# EAGLE design Dashboard Logic (EAGLE 5.11)
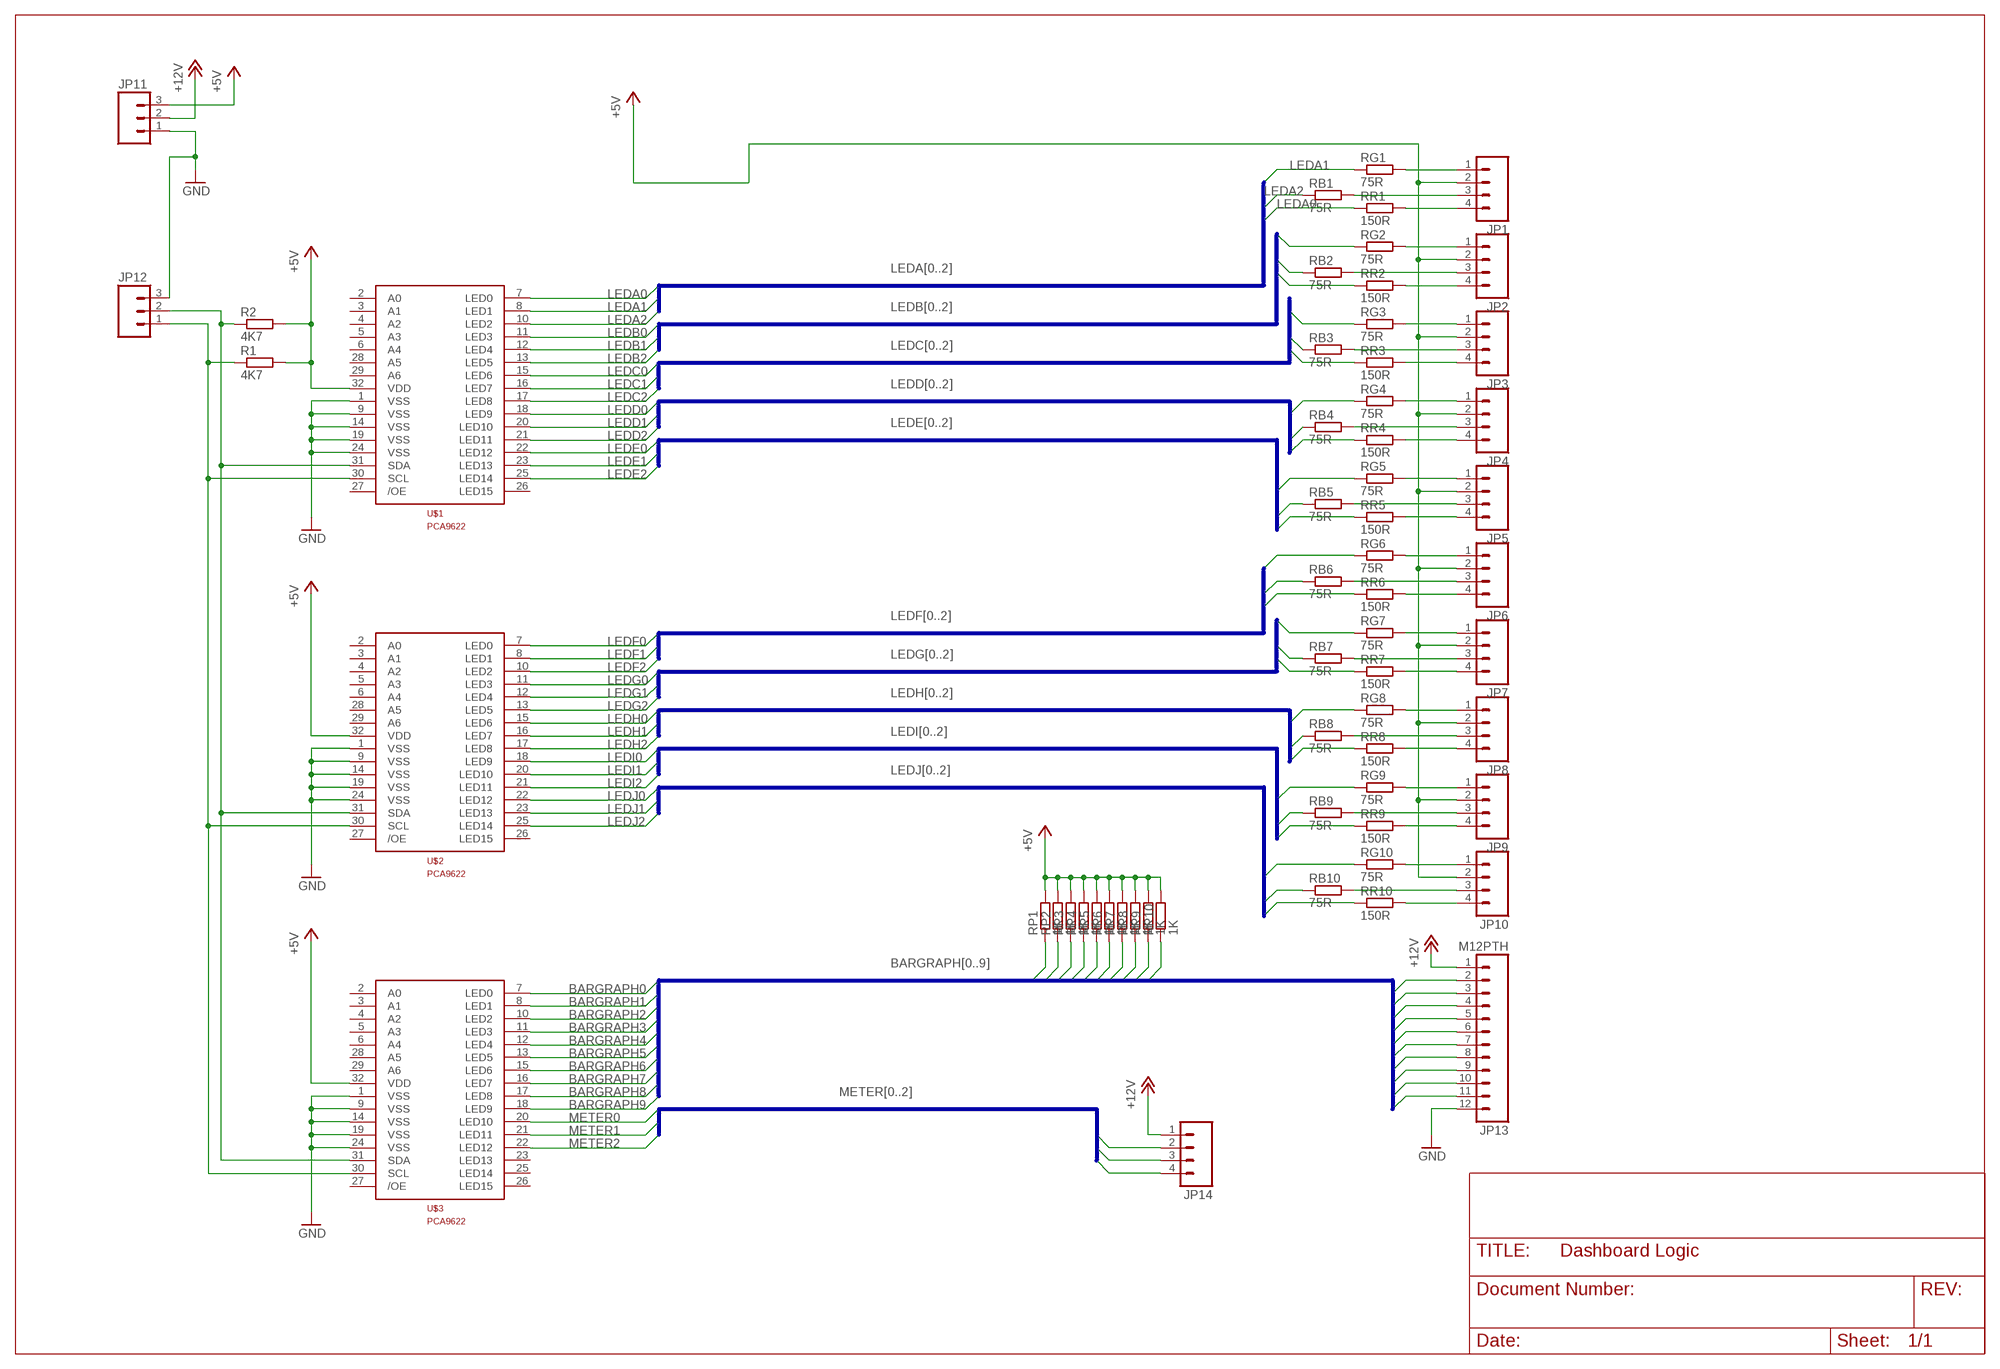
[diagram p0: schematic, sheet 1]

## Parts
JP1  M04PTH  [1X04]
JP2  M04PTH  [1X04]
JP3  M04PTH  [1X04]
JP4  M04PTH  [1X04]
JP5  M04PTH  [1X04]
JP6  M04PTH  [1X04]
JP7  M04PTH  [1X04]
JP8  M04PTH  [1X04]
JP9  M04PTH  [1X04]
JP10  M04PTH  [1X04]
JP11  M03PTH  [1X03]
JP12  M03PTH  [1X03]
JP13  M12PTH  [1X12]
JP14  M04PTH  [1X04]
R1  4K7  R-EU_R0805  [R0805]
R2  4K7  R-EU_R0805  [R0805]
RB1  75R  R-EU_R0805  [R0805]
RB2  75R  R-EU_R0805  [R0805]
RB3  75R  R-EU_R0805  [R0805]
RB4  75R  R-EU_R0805  [R0805]
RB5  75R  R-EU_R0805  [R0805]
RB6  75R  R-EU_R0805  [R0805]
RB7  75R  R-EU_R0805  [R0805]
RB8  75R  R-EU_R0805  [R0805]
RB9  75R  R-EU_R0805  [R0805]
RB10  75R  R-EU_R0805  [R0805]
RG1  75R  R-EU_R0805  [R0805]
RG2  75R  R-EU_R0805  [R0805]
RG3  75R  R-EU_R0805  [R0805]
RG4  75R  R-EU_R0805  [R0805]
RG5  75R  R-EU_R0805  [R0805]
RG6  75R  R-EU_R0805  [R0805]
RG7  75R  R-EU_R0805  [R0805]
RG8  75R  R-EU_R0805  [R0805]
RG9  75R  R-EU_R0805  [R0805]
RG10  75R  R-EU_R0805  [R0805]
RP1  1K  R-EU_R0805  [R0805]
RP2  1K  R-EU_R0805  [R0805]
RP3  1K  R-EU_R0805  [R0805]
RP4  1K  R-EU_R0805  [R0805]
RP5  1K  R-EU_R0805  [R0805]
RP6  1K  R-EU_R0805  [R0805]
RP7  1K  R-EU_R0805  [R0805]
RP8  1K  R-EU_R0805  [R0805]
RP9  1K  R-EU_R0805  [R0805]
RP10  1K  R-EU_R0805  [R0805]
RR1  150R  R-EU_R0805  [R0805]
RR2  150R  R-EU_R0805  [R0805]
RR3  150R  R-EU_R0805  [R0805]
RR4  150R  R-EU_R0805  [R0805]
RR5  150R  R-EU_R0805  [R0805]
RR6  150R  R-EU_R0805  [R0805]
RR7  150R  R-EU_R0805  [R0805]
RR8  150R  R-EU_R0805  [R0805]
RR9  150R  R-EU_R0805  [R0805]
RR10  150R  R-EU_R0805  [R0805]
U$1  PCA9622  [HTSSOP32DAP]
U$2  PCA9622  [HTSSOP32DAP]
U$3  PCA9622  [HTSSOP32DAP]

## Nets
+5V: JP1.2 JP2.2 JP3.2 JP4.2 JP5.2 JP6.2 JP7.2 JP8.2 JP9.2 JP10.2 JP11.3 R1.2 R2.2 RP1.2 RP2.2 RP3.2 RP4.2 RP5.2 RP6.2 RP7.2 RP8.2 RP9.2 RP10.2 U$1.32(VDD) U$2.32(VDD) U$3.32(VDD)
+12V: JP11.2 JP13.1 JP14.1
BARGRAPH0: JP13.2 RP1.1 U$3.7(LED0)
BARGRAPH1: JP13.3 RP2.1 U$3.8(LED1)
BARGRAPH2: JP13.4 RP3.1 U$3.10(LED2)
BARGRAPH3: JP13.5 RP4.1 U$3.11(LED3)
BARGRAPH4: JP13.6 RP5.1 U$3.12(LED4)
BARGRAPH5: JP13.7 RP6.1 U$3.13(LED5)
BARGRAPH6: JP13.8 RP7.1 U$3.15(LED6)
BARGRAPH7: JP13.9 RP8.1 U$3.16(LED7)
BARGRAPH8: JP13.10 RP9.1 U$3.17(LED8)
BARGRAPH9: JP13.11 RP10.1 U$3.18(LED9)
GND: JP11.1 JP12.3 JP13.12 U$1.1(VSS) U$1.9(VSS) U$1.14(VSS) U$1.19(VSS) U$1.24(VSS) U$2.1(VSS) U$2.9(VSS) U$2.14(VSS) U$2.19(VSS) U$2.24(VSS) U$3.1(VSS) U$3.9(VSS) U$3.14(VSS) U$3.19(VSS) U$3.24(VSS)
LEDA0: RR1.1 U$1.7(LED0)
LEDA1: RG1.1 U$1.8(LED1)
LEDA2: RB1.1 U$1.10(LED2)
LEDB0: RR2.1 U$1.11(LED3)
LEDB1: RG2.1 U$1.12(LED4)
LEDB2: RB2.1 U$1.13(LED5)
LEDC0: RR3.1 U$1.15(LED6)
LEDC1: RG3.1 U$1.16(LED7)
LEDC2: RB3.1 U$1.17(LED8)
LEDD0: RR4.1 U$1.18(LED9)
LEDD1: RG4.1 U$1.20(LED10)
LEDD2: RB4.1 U$1.21(LED11)
LEDE0: RR5.1 U$1.22(LED12)
LEDE1: RG5.1 U$1.23(LED13)
LEDE2: RB5.1 U$1.25(LED14)
LEDF0: RR6.1 U$2.7(LED0)
LEDF1: RG6.1 U$2.8(LED1)
LEDF2: RB6.1 U$2.10(LED2)
LEDG0: RR7.1 U$2.11(LED3)
LEDG1: RG7.1 U$2.12(LED4)
LEDG2: RB7.1 U$2.13(LED5)
LEDH0: RR8.1 U$2.15(LED6)
LEDH1: RG8.1 U$2.16(LED7)
LEDH2: RB8.1 U$2.17(LED8)
LEDI0: RR9.1 U$2.18(LED9)
LEDI1: RG9.1 U$2.20(LED10)
LEDI2: RB9.1 U$2.21(LED11)
LEDJ0: RR10.1 U$2.22(LED12)
LEDJ1: RG10.1 U$2.23(LED13)
LEDJ2: RB10.1 U$2.25(LED14)
METER0: JP14.2 U$3.20(LED10)
METER1: JP14.3 U$3.21(LED11)
METER2: JP14.4 U$3.22(LED12)
N$1: JP12.2 R2.1 U$1.31(SDA) U$2.31(SDA) U$3.31(SDA)
N$2: JP1.1 RG1.2
N$3: JP1.3 RB1.2
N$4: JP1.4 RR1.2
N$5: JP10.4 RR10.2
N$6: JP12.1 R1.1 U$1.30(SCL) U$2.30(SCL) U$3.30(SCL)
N$7: JP10.3 RB10.2
N$8: JP10.1 RG10.2
N$9: JP9.4 RR9.2
N$10: JP9.3 RB9.2
N$11: JP9.1 RG9.2
N$12: JP8.4 RR8.2
N$13: JP8.3 RB8.2
N$14: JP8.1 RG8.2
N$15: JP7.4 RR7.2
N$16: JP7.3 RB7.2
N$17: JP7.1 RG7.2
N$18: JP6.4 RR6.2
N$19: JP6.3 RB6.2
N$20: JP6.1 RG6.2
N$21: JP5.4 RR5.2
N$22: JP5.3 RB5.2
N$23: JP5.1 RG5.2
N$24: JP4.4 RR4.2
N$25: JP4.3 RB4.2
N$26: JP4.1 RG4.2
N$27: JP3.4 RR3.2
N$28: JP3.3 RB3.2
N$29: JP3.1 RG3.2
N$30: JP2.4 RR2.2
N$31: JP2.3 RB2.2
N$32: JP2.1 RG2.2
Unconnected: U$1.2(A0) U$1.3(A1) U$1.4(A2) U$1.5(A3) U$1.6(A4) U$1.26(LED15) U$1.27(/OE) U$1.28(A5) U$1.29(A6) U$2.2(A0) U$2.3(A1) U$2.4(A2) U$2.5(A3) U$2.6(A4) U$2.26(LED15) U$2.27(/OE) U$2.28(A5) U$2.29(A6) U$3.2(A0) U$3.3(A1) U$3.4(A2) U$3.5(A3) U$3.6(A4) U$3.23(LED13) U$3.25(LED14) U$3.26(LED15) U$3.27(/OE) U$3.28(A5) U$3.29(A6)

## Buses
LEDA[0..2]
LEDB[0..2]
LEDC[0..2]
LEDD[0..2]
LEDE[0..2]
LEDF[0..2]
LEDG[0..2]
LEDH[0..2]
LEDI[0..2]
LEDJ[0..2]
BARGRAPH[0..9]
METER[0..2]

## Library data of the parts
JP1-JP10 JP14 = SparkFun:M04: Header 4 Standard 4-pin 0.1" header. Use with straight break away headers (SKU : PRT-00116), right angle break away headers (PRT-00553), swiss pins (PRT-00743), machine pins (PRT-00117), and female headers (PRT-00115). Molex polarized connector foot print use with SKU : PRT-08231 with associated crimp pins and housings. 1MM SMD Version SKU: PRT-10208
JP11 JP12 = SparkFun:M03: Header 3 Standard 3-pin 0.1" header. Use with straight break away headers (SKU : PRT-00116), right angle break away headers (PRT-00553), swiss pins (PRT-00743), machine pins (PRT-00117), and female headers (PRT-00115). Molex polarized connector foot print use with SKU : PRT-08232 with associated crimp pins and housings.
JP13 = SparkFun:M12: Header 12 Standard 12-pin 0.1" header. Use with straight break away headers (SKU : PRT-00116), right angle break away headers (PRT-00553), swiss pins (PRT-00743), machine pins (PRT-00117), and female headers (PRT-00115).
R1 R2 RB1-RB10 RG1-RG10 RP1-RP10 RR1-RR10 = resistor:R-EU_: RESISTOR, European symbol
U$1-U$3 = DashboardParts:PCA9622

## Board
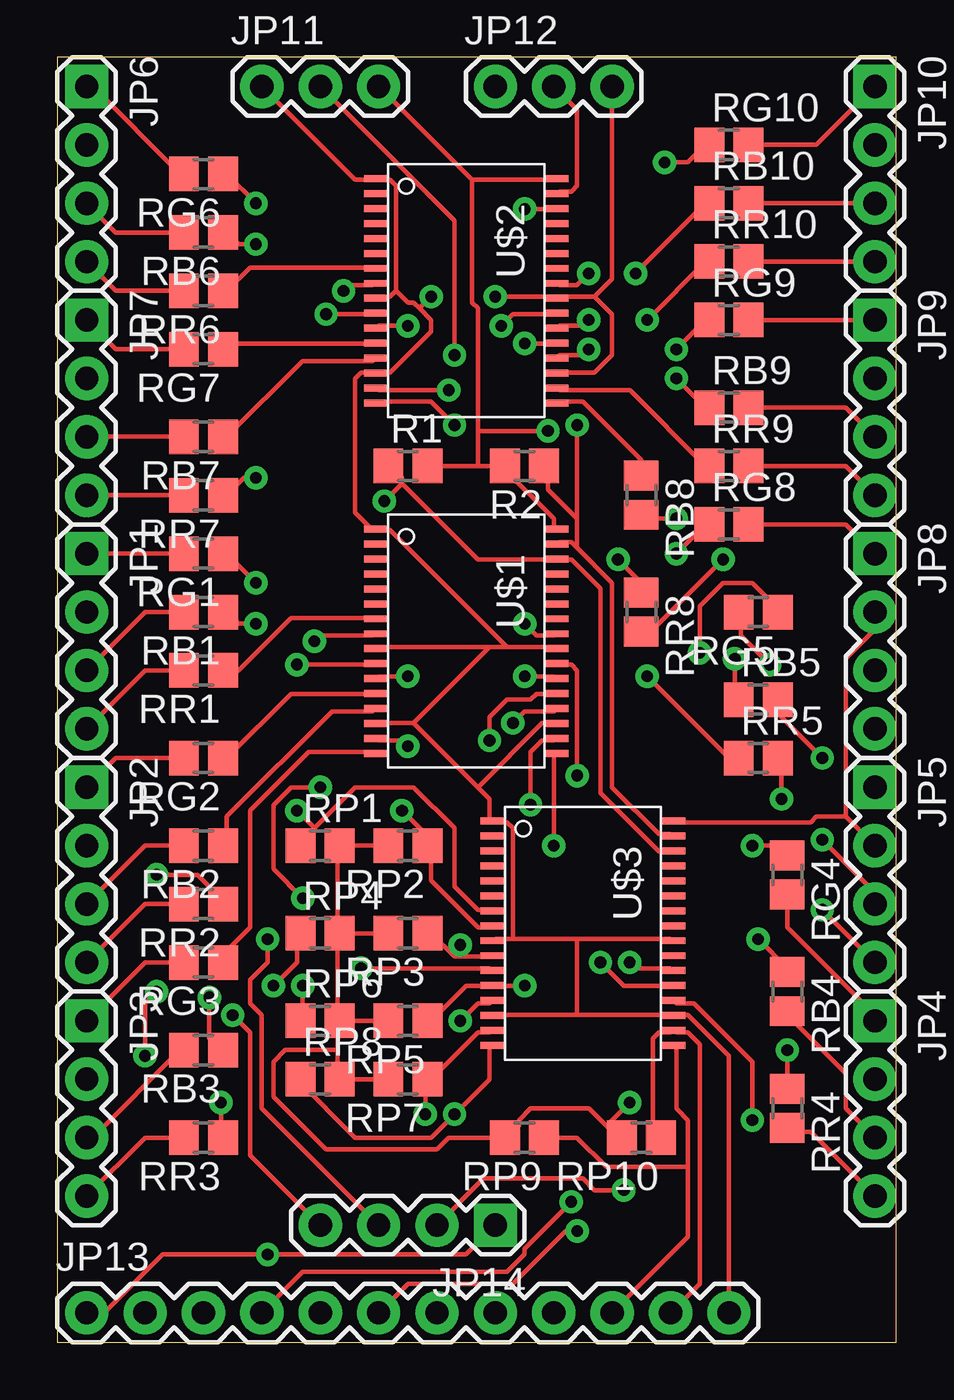
[diagram p1: board, top side]
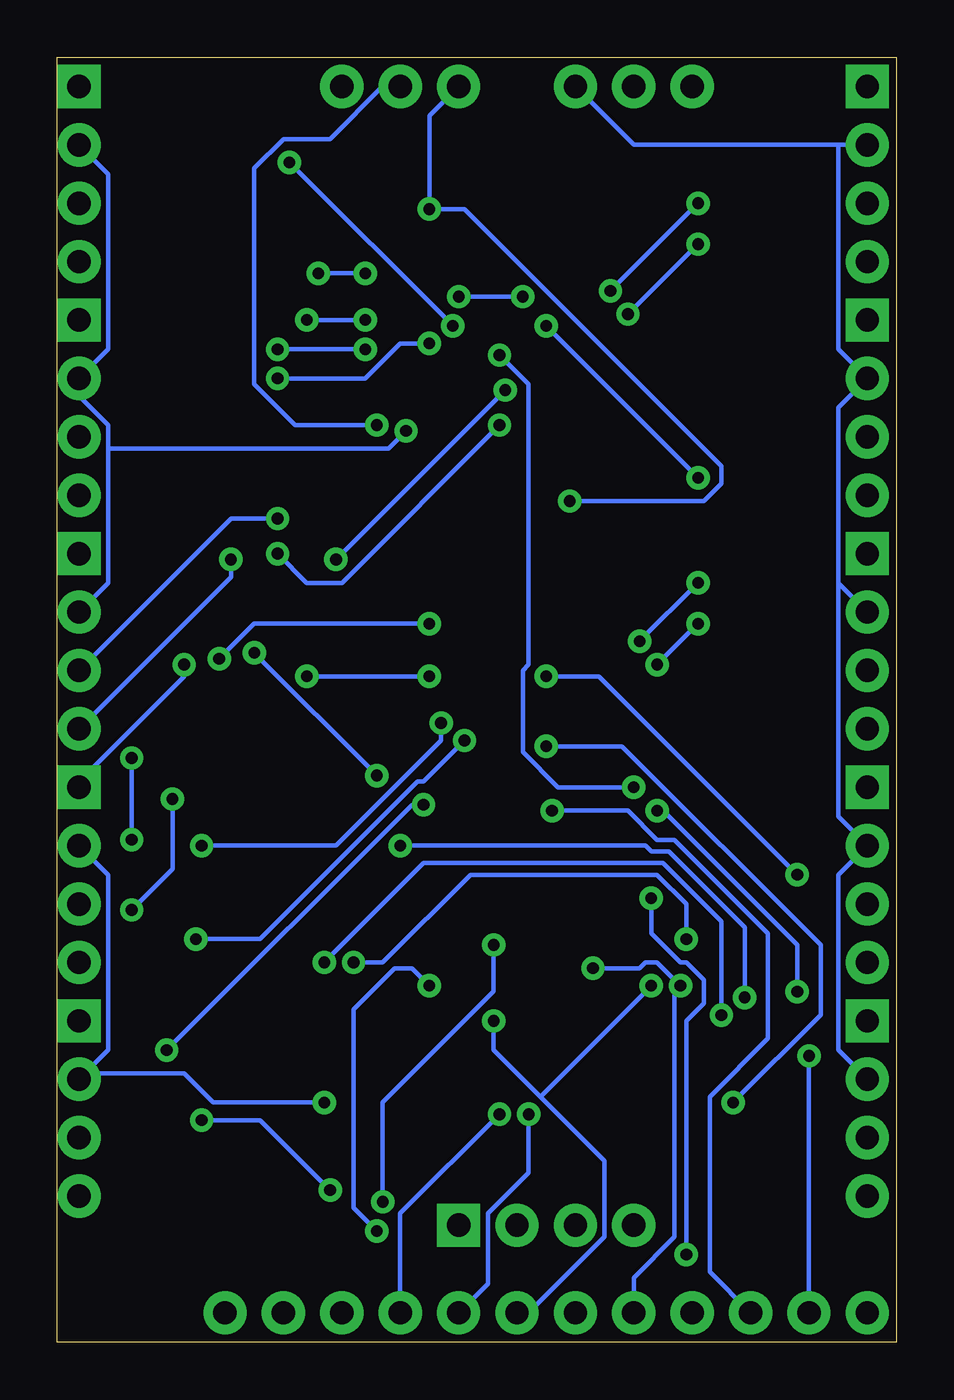
[diagram p2: board, bottom side, seen from below]

Size 36.5 x 55.87 mm. Coordinates in mm from the lower left corner, seen from the top.
Outline: 0,0 36.5,0 36.5,55.87 0,55.87 0,0
Copper layers (1*16): Top 0.035mm / dielectric 1.5mm / Bottom 0.035mm
Design rules "SparkFun *": minimum track width 8mil, minimum drill 20mil, track to track 8mil, track to pad 8mil, pad to pad 8mil, via to via 8mil, smd to smd 8mil, copper to edge 0mil, drill to drill 8mil, minimum pad ring 12mil, minimum via ring 10mil, stop-mask expansion 4mil, vias tented up to drill 25mil, thermal gap 10mil

### Footprints (pad centres in the part's own frame; a part is rotated, then mirrored left to right if it is on the bottom)
1X04 = drill 1.016 pad 1.88 square: 1 0,0 | drill 1.016 pad 1.88 round: 2 2.54,0; 3 5.08,0; 4 7.62,0
1X03 = drill 1.016 pad 1.88 round: 1 0,0; 2 2.54,0; 3 5.08,0
1X12 = drill 1.016 pad 1.88 round: 1 0,0; 2 2.54,0; 3 5.08,0; 4 7.62,0; 5 10.16,0; 6 12.7,0; 7 15.24,0; 8 17.78,0; 9 20.32,0; 10 22.86,0; 11 25.4,0; 12 27.94,0
R0805 = smd 1.3 x 1.5: 1 -0.85,0; 2 0.85,0
HTSSOP32DAP = smd 0.3 x 1: 1 -4.875,-3.95; 2 -4.225,-3.95; 3 -3.575,-3.95; 4 -2.925,-3.95; 5 -2.275,-3.95; 6 -1.625,-3.95; 7 -0.975,-3.95; 8 -0.325,-3.95; 9 0.325,-3.95; 10 0.975,-3.95; 11 1.625,-3.95; 12 2.275,-3.95; 13 2.925,-3.95; 14 3.575,-3.95; 15 4.225,-3.95; 16 4.875,-3.95; 17 4.875,3.95; 18 4.225,3.95; 19 3.575,3.95; 20 2.925,3.95; 21 2.275,3.95; 22 1.625,3.95; 23 0.975,3.95; 24 0.325,3.95; 25 -0.325,3.95; 26 -0.975,3.95; 27 -1.625,3.95; 28 -2.275,3.95; 29 -2.925,3.95; 30 -3.575,3.95; 31 -4.225,3.95; 32 -4.875,3.95

### Placement (x,y rotation side)
JP1  1.27,34.29 270 top
JP2  1.27,24.13 270 top
JP3  1.27,13.97 270 top
JP4  35.56,13.97 270 top
JP5  35.56,24.13 270 top
JP6  1.27,54.61 270 top
JP7  1.27,44.45 270 top
JP8  35.56,34.29 270 top
JP9  35.56,44.45 270 top
JP10  35.56,54.61 270 top
JP11  8.89,54.61 0 top
JP12  19.05,54.61 0 top
JP13  1.27,1.27 0 top
JP14  19.05,5.08 180 top
R1  15.24,38.1 0 top
R2  20.32,38.1 180 top
RB1  6.35,31.75 180 top
RB2  6.35,21.59 180 top
RB3  6.35,12.7 180 top
RB4  31.75,15.24 270 top
RB5  30.48,27.94 0 top
RB6  6.35,48.26 180 top
RB7  6.35,39.37 180 top
RB8  25.4,36.83 270 top
RB9  29.21,40.64 0 top
RB10  29.21,49.53 0 top
RG1  6.35,34.29 180 top
RG2  6.35,25.4 180 top
RG3  6.35,16.51 180 top
RG4  31.75,20.32 270 top
RG5  30.48,31.75 180 top
RG6  6.35,50.8 180 top
RG7  6.35,43.18 180 top
RG8  29.21,35.56 0 top
RG9  29.21,44.45 0 top
RG10  29.21,52.07 0 top
RP1  11.43,21.59 0 top
RP2  15.24,21.59 180 top
RP3  15.24,17.78 180 top
RP4  11.43,17.78 0 top
RP5  15.24,13.97 180 top
RP6  11.43,13.97 0 top
RP7  15.24,11.43 180 top
RP8  11.43,11.43 0 top
RP9  20.32,8.89 180 top
RP10  25.4,8.89 180 top
RR1  6.35,29.21 180 top
RR2  6.35,19.05 180 top
RR3  6.35,8.89 180 top
RR4  31.75,10.16 270 top
RR5  30.48,25.4 0 top
RR6  6.35,45.72 180 top
RR7  6.35,36.83 180 top
RR8  25.4,31.75 270 top
RR9  29.21,38.1 0 top
RR10  29.21,46.99 0 top
U$1  17.78,30.48 270 top
U$2  17.78,45.72 270 top
U$3  22.86,17.78 270 top

### Tracks (layer width: path | path; a pad name or v marks a point on that pad's centre or on a via)
+5V  (via drill 0.51)
  Top 0.203: 19.3,38.1 21.59,35.81 21.59,35.31 U$1.32 | 18.29,38.1 19.3,38.1 | 18.29,38.1 R1.2 | 19.3,38.1 R2.2 | 18.03,50.55 21.59,50.55 U$2.32 | JP11.3 18.03,50.55 | 18.29,39.62 18.29,44.96 18.03,45.21 18.03,50.55 | 18.29,39.62 18.29,38.1 | 23.88,9.4 24.38,8.89 RP10.2 | 23.88,9.4 23.11,10.16 20.57,10.16 20.07,9.65 20.07,9.4 19.56,8.89 RP9.2 17.02,8.89 16.51,8.38 11.68,8.38 9.4,10.67 9.4,12.19 9.91,12.7 12.19,12.7 | RP7.2 RP8.2 12.19,11.43 12.19,12.7 | RP5.2 RP6.2 12.19,13.97 | 12.19,12.7 12.19,13.97 | RP3.2 RP4.2 12.19,17.78 | RP2.2 RP1.2 12.19,21.59 12.19,17.78 | 12.19,13.97 12.19,17.78 | 34.29,22.86 33.02,22.86 32.77,22.61 26.92,22.61 U$3.32 | 34.29,22.86 JP5.2 | JP8.2 35.56,30.99 34.29,29.72 34.29,22.86 | v24.89,10.41 23.88,9.4 | 18.29,39.62 v21.34,39.62
  Bottom 0.203: JP3.2 2.54,12.7 2.54,20.32 JP2.2 2.54,22.86 2.54,33.02 | 2.54,33.02 JP1.2 | 2.54,33.02 2.54,40.64 JP7.2 2.54,43.18 2.54,52.07 | 2.54,52.07 11.43,52.07 JP11.3 | 2.54,52.07 JP6.2 | JP10.2 34.29,50.8 34.29,43.18 JP9.2 35.56,41.15 34.29,39.88 34.29,38.86 | 35.31,11.68 34.29,12.7 34.29,20.32 JP5.2 | 34.29,38.86 34.29,33.02 JP8.2 | v24.89,10.41 29.72,10.41 30.99,11.68 35.31,11.68 | 35.31,11.68 JP4.2 | v21.34,39.62 22.1,38.86 34.29,38.86
+12V  (via drill 0.51)
  Top 0.203: JP13.1 2.03,1.27 4.57,3.81 v9.14,3.81 17.78,3.81 JP14.1 | JP11.2 17.27,48.77 v17.27,42.93 | v11.43,24.13 10.16,24.13 9.4,23.37 9.4,20.57 v10.67,19.3
  Bottom 0.203: v17.27,42.93 16,41.66 16,29.46 16.26,29.21 16.26,25.65 14.73,24.13 v11.43,24.13 | v10.67,19.3 10.67,17.78 9.4,16.51 9.14,16.51 8.38,15.75 8.38,14.73 9.14,13.97 v9.14,3.81
BARGRAPH0  (via drill 0.51)
  Top 0.203: 11.18,22.35 10.41,21.59 RP1.1 | 11.18,22.35 12.95,24.13 15.49,24.13 17.27,22.35 17.27,19.81 18.29,18.8 18.8,18.8 U$3.7 | v3.81,12.45 3.81,14.73 v4.32,15.24 | v10.41,23.11 11.18,22.35
  Bottom 0.203: JP13.2 v3.81,12.45 | v4.32,15.24 4.32,17.27 10.16,23.11 v10.41,23.11
BARGRAPH1  (via drill 0.51)
  Top 0.203: U$3.8 18.8,18.03 18.29,18.03 16.26,20.07 16.26,21.59 RP2.1 16,21.59 16,22.1 v14.99,23.11
  Bottom 0.203: v14.99,23.11 11.68,23.11 10.41,21.84 9.65,21.84 5.59,17.78 5.59,13.21 8.13,10.67 8.13,3.05 JP13.3
BARGRAPH2  (via drill 0.51)
  Top 0.203: 17.53,16.76 17.27,16.76 16.26,17.78 RP3.1 | 17.53,16.76 18.8,16.76 U$3.10 | v17.53,17.27 17.53,16.76 | v22.35,6.1 20.32,4.06 20.32,3.81 19.56,3.05 10.67,3.05 JP13.4
  Bottom 0.203: v17.53,17.27 17.53,15.24 22.35,10.41 v22.35,6.1
BARGRAPH3  (via drill 0.51)
  Top 0.203: v13.21,16.26 18.8,16.26 U$3.11 | v9.4,15.49 10.41,16.51 10.41,17.78 RP4.1
  Bottom 0.203: v13.21,16.26 11.18,16.26 10.92,16.51 10.41,16.51 9.65,15.75 9.65,15.49 | 9.65,15.49 9.65,4.57 11.43,2.79 JP13.5 | 9.65,15.49 v9.4,15.49
BARGRAPH4  (via drill 0.51)
  Top 0.203: RP5.1 16.26,13.97 17.78,15.49 18.8,15.49 U$3.12 19.05,15.49 v20.32,15.49 | v22.61,4.83 22.1,4.83 19.81,2.54 15.24,2.54 JP13.6
  Bottom 0.203: v20.32,15.49 21.08,16.26 21.84,16.26 23.62,14.48 23.62,5.84 v22.61,4.83
BARGRAPH5  (via drill 0.51)
  Top 0.203: v17.53,13.97 18.29,14.73 18.8,14.73 U$3.13 | v10.67,15.49 10.67,13.97 RP6.1
  Bottom 0.203: v17.53,13.97 17.53,12.7 15.49,10.67 | 15.49,10.67 12.7,7.87 12.7,4.57 16,1.27 JP13.7 | 15.49,10.67 v10.67,15.49
BARGRAPH6  (via drill 0.51)
  Top 0.203: U$3.15 18.8,13.46 18.29,13.46 16.26,11.43 RP7.1 16,11.43 v16,9.91
  Bottom 0.203: v16,9.91 16,7.37 17.78,5.59 17.78,2.54 JP13.8
BARGRAPH7  (via drill 0.51)
  Top 0.203: U$3.16 18.8,12.95 18.8,11.43 v17.27,9.91 16.26,8.89 12.95,8.89 10.41,11.43 RP8.1
  Bottom 0.203: JP13.9 21.59,5.59 v17.27,9.91
BARGRAPH8
  Top 0.203: 27.43,7.62 27.43,4.57 JP13.10 | 27.43,7.62 27.43,9.65 26.92,10.16 26.92,12.95 U$3.17 | 27.43,7.62 23.88,7.62 22.61,8.89 RP9.1
BARGRAPH9
  Top 0.203: RP10.1 26.16,8.89 25.91,9.14 25.91,13.21 26.16,13.46 26.67,13.46 U$3.18 26.92,13.46 27.43,13.46 27.94,12.95 27.94,2.54 JP13.11
GND  (via drill 0.51)
  Top 0.203: 22.61,14.22 26.67,14.22 U$3.19 26.92,14.22 27.43,14.22 29.21,12.45 JP13.12 | 22.61,14.22 19.05,14.22 U$3.14 | 22.61,17.53 26.67,17.53 U$3.24 | 22.61,17.53 19.81,17.53 | 19.81,17.53 19.05,17.53 U$3.9 | 19.81,17.53 19.81,22.35 19.56,22.61 19.05,22.61 U$3.1 18.8,22.61 18.8,23.62 18.29,24.13 | 15.49,26.92 13.97,26.92 U$1.14 | 18.29,24.13 15.49,26.92 | 18.29,24.13 21.08,26.92 21.59,26.92 U$1.19 | 22.61,14.22 22.61,17.53 | 23.37,45.47 24.13,44.7 24.13,42.93 23.37,42.16 21.84,42.16 U$2.19 | 23.37,45.47 21.84,45.47 U$2.24 21.59,45.47 v19.05,45.47 | 23.37,45.47 24.13,46.23 JP12.3 | 14.73,45.72 14.48,45.47 13.97,45.47 U$2.9 | 14.73,45.72 14.73,50.29 14.48,50.55 13.97,50.55 U$2.1 13.72,50.55 12.95,50.55 JP11.1 | 19.56,30.23 21.59,30.23 U$1.24 | 18.8,30.23 19.56,30.23 | 18.8,30.23 13.97,30.23 U$1.9 | 19.56,30.23 14.48,35.31 13.97,35.31 U$1.1 13.72,35.31 12.95,36.07 12.95,41.91 13.21,42.16 13.72,42.16 U$2.14 13.97,42.16 14.48,42.16 16.26,43.94 16.26,44.45 15.75,44.96 | 14.73,45.72 15.24,45.21 15.49,45.21 15.75,44.96 | 15.75,44.96 v16.26,45.47 | 15.49,26.92 18.8,30.23
  Bottom 0.203: v16.26,45.47 v19.05,45.47
LEDA0
  Top 0.203: U$1.7 13.72,31.5 10.16,31.5 7.87,29.21 RR1.1
LEDA1  (via drill 0.51)
  Top 0.203: v11.18,30.48 11.43,30.73 13.72,30.73 U$1.8 | v8.64,33.02 7.37,34.29 RG1.1
  Bottom 0.203: v8.64,33.02 v11.18,30.48
LEDA2  (via drill 0.51)
  Top 0.203: v10.41,29.46 13.72,29.46 U$1.10 | v8.64,31.24 7.87,31.24 7.37,31.75 RB1.1
  Bottom 0.203: v8.64,31.24 v10.41,29.46
LEDB0  (via drill 0.51)
  Top 0.203: v15.24,28.96 13.97,28.96 U$1.11 | v4.32,20.32 6.1,20.32 7.37,19.05 RR2.1
  Bottom 0.203: v15.24,28.96 12.95,28.96 v4.32,20.32
LEDB1
  Top 0.203: U$1.12 13.72,28.19 10.16,28.19 7.37,25.4 RG2.1
LEDB2
  Top 0.203: U$1.13 13.72,27.43 11.94,27.43 7.37,22.86 7.37,21.59 RB2.1
LEDC0  (via drill 0.51)
  Top 0.203: v15.24,25.91 14.99,26.16 13.97,26.16 U$1.15 | v7.11,10.41 7.11,8.89 RR3.1
  Bottom 0.203: v15.24,25.91 11.94,25.91 3.3,17.27 3.3,14.22 v7.11,10.41
LEDC1
  Top 0.203: U$1.16 13.72,25.65 10.92,25.65 8.38,23.11 8.38,18.03 7.37,17.02 7.37,16.51 RG3.1
LEDC2  (via drill 0.51)
  Top 0.203: v21.59,21.59 21.59,25.65 U$1.17 | v6.6,14.99 6.6,13.21 7.11,12.7 RB3.1
  Bottom 0.203: v21.59,21.59 10.92,21.59 10.67,21.34 9.91,21.34 6.6,18.03 v6.6,14.99
LEDD0  (via drill 0.51)
  Top 0.203: v20.57,23.37 20.57,25.65 21.08,26.16 21.59,26.16 U$1.18 | RR4.1 v31.75,12.7
  Bottom 0.203: v20.57,23.37 21.08,23.37 v31.75,12.7
LEDD1  (via drill 0.51)
  Top 0.203: v19.81,26.92 20.32,27.43 21.59,27.43 U$1.20 | v30.23,21.59 31.5,21.59 31.75,21.34 RG4.1
  Bottom 0.203: v19.81,26.92 19.81,26.16 24.38,21.59 v30.23,21.59
LEDD2  (via drill 0.51)
  Top 0.203: v18.8,26.16 18.8,27.18 19.56,27.94 20.57,27.94 20.83,28.19 21.59,28.19 U$1.21 | v30.48,17.53 31.75,16.26 RB4.1
  Bottom 0.203: v18.8,26.16 20.57,24.38 20.83,24.38 27.69,17.53 v30.48,17.53
LEDE0  (via drill 0.51)
  Top 0.203: v20.32,28.96 21.59,28.96 U$1.22 | v25.65,28.96 29.21,25.4 RR5.1
  Bottom 0.203: v20.32,28.96 v25.65,28.96
LEDE1  (via drill 0.51)
  Top 0.203: v22.61,24.64 22.61,29.21 22.35,29.46 21.84,29.46 U$1.23 | v27.94,29.97 27.94,32 28.96,33.02 30.23,33.02 31.5,31.75 RG5.1
  Bottom 0.203: v22.61,24.64 v27.94,29.97
LEDE2  (via drill 0.51)
  Top 0.203: v20.32,31.24 20.83,30.73 21.59,30.73 U$1.25 | v29.46,29.72 29.46,27.94 RB5.1
  Bottom 0.203: v20.32,31.24 27.94,31.24 v29.46,29.72
LEDF0
  Top 0.203: U$2.7 13.72,46.74 8.38,46.74 7.37,45.72 RR6.1
LEDF1  (via drill 0.51)
  Top 0.203: v12.45,45.72 12.7,45.97 13.72,45.97 U$2.8 | v8.64,49.53 7.37,50.8 RG6.1
  Bottom 0.203: v8.64,49.53 v12.45,45.72
LEDF2  (via drill 0.51)
  Top 0.203: v11.68,44.7 13.72,44.7 U$2.10 | v8.64,47.75 7.87,47.75 7.37,48.26 RB6.1
  Bottom 0.203: v8.64,47.75 v11.68,44.7
LEDG0  (via drill 0.51)
  Top 0.203: v15.24,44.2 13.97,44.2 U$2.11 | v8.64,37.59 8.13,37.59 7.37,36.83 RR7.1
  Bottom 0.203: v8.64,37.59 v15.24,44.2
LEDG1
  Top 0.203: U$2.12 13.72,43.43 7.62,43.43 7.37,43.18 RG7.1
LEDG2
  Top 0.203: U$2.13 13.72,42.67 10.67,42.67 7.37,39.37 RB7.1
LEDH0  (via drill 0.51)
  Top 0.203: v17.02,41.4 13.97,41.4 U$2.15 | v24.38,34.04 25.4,33.02 RR8.1
  Bottom 0.203: v17.02,41.4 v24.38,34.04
LEDH1  (via drill 0.51)
  Top 0.203: v17.27,39.88 16.26,40.89 13.97,40.89 U$2.16 | v26.92,34.29 28.19,35.56 RG8.1
  Bottom 0.203: v17.27,39.88 24.13,33.02 25.65,33.02 v26.92,34.29
LEDH2
  Top 0.203: U$2.17 21.84,40.89 22.86,40.89 25.4,38.35 RB8.1
LEDI0
  Top 0.203: U$2.18 21.84,41.4 24.89,41.4 28.19,38.1 RR9.1
LEDI1  (via drill 0.51)
  Top 0.203: v23.11,43.18 22.86,42.93 21.84,42.93 U$2.20 | v26.92,43.18 28.19,44.45 RG9.1
  Bottom 0.203: v23.11,43.18 v26.92,43.18
LEDI2  (via drill 0.51)
  Top 0.203: v20.32,43.43 21.59,43.43 U$2.21 | v26.92,41.91 28.19,40.64 RB9.1
  Bottom 0.203: v20.32,43.43 21.59,43.43 23.11,41.91 v26.92,41.91
LEDJ0  (via drill 0.51)
  Top 0.203: v23.11,44.45 22.86,44.2 21.84,44.2 U$2.22 | v25.65,44.45 28.19,46.99 RR10.1
  Bottom 0.203: v23.11,44.45 v25.65,44.45
LEDJ1  (via drill 0.51)
  Top 0.203: v19.3,44.2 19.81,44.7 21.59,44.7 U$2.23 | v26.42,51.31 27.43,51.31 28.19,52.07 RG10.1
  Bottom 0.203: v19.3,44.2 v26.42,51.31
LEDJ2  (via drill 0.51)
  Top 0.203: v23.11,46.48 22.61,45.97 21.84,45.97 U$2.25 | v25.15,46.48 28.19,49.53 RB10.1
  Bottom 0.203: v23.11,46.48 v25.15,46.48
METER0  (via drill 0.51)
  Top 0.203: v30.23,9.65 30.23,12.19 27.69,14.73 26.92,14.73 U$3.20 | v24.64,6.6 23.37,6.6 22.86,7.11 18.54,7.11 JP14.2
  Bottom 0.203: v30.23,9.65 27.69,9.65 v24.64,6.6
METER1  (via drill 0.51)
  Top 0.203: v23.62,16.51 24.64,15.49 26.67,15.49 U$3.21 | v9.14,17.53 9.14,16.51 8.38,15.75 8.38,14.73 8.89,14.22 8.89,10.16 JP14.3
  Bottom 0.203: v23.62,16.51 22.35,16.51 18.54,20.32 10.41,20.32 9.14,19.05 v9.14,17.53
METER2  (via drill 0.51)
  Top 0.203: v24.89,16.51 25.15,16.26 26.67,16.26 U$3.22 | v7.62,14.22 8.38,13.46 8.38,8.13 JP14.4
  Bottom 0.203: v24.89,16.51 20.57,20.83 10.16,20.83 7.62,18.29 v7.62,14.22
N$1  (via drill 0.51)
  Top 0.203: JP12.2 22.61,53.59 22.61,50.29 22.35,50.04 21.84,50.04 U$2.31 | 22.61,34.54 22.35,34.8 21.84,34.8 U$1.31 | 22.61,34.54 24.13,33.02 24.13,24.13 26.16,22.1 26.67,22.1 U$3.31 | 22.61,35.81 21.34,37.08 21.34,38.1 R2.1 | 22.61,34.54 22.61,35.81 | 22.61,35.81 v22.61,39.88
  Bottom 0.203: JP12.2 22.35,54.61 24.64,52.32 26.67,52.32 27.94,51.05 27.94,41.66 26.16,39.88 v22.61,39.88
N$2
  Top 0.203: JP1.1 RG1.2
N$3
  Top 0.203: JP1.3 3.81,31.75 RB1.2
N$4
  Top 0.203: JP1.4 3.81,29.21 RR1.2
N$5
  Top 0.203: RR10.2 JP10.4
N$6  (via drill 0.51)
  Top 0.203: v20.32,49.28 21.59,49.28 U$2.30 | U$3.30 26.67,21.34 26.16,21.34 23.62,23.88 23.62,32.77 22.35,34.04 21.84,34.04 U$1.30 21.59,34.04 18.29,34.04 14.99,37.34 | 14.99,37.34 14.99,37.59 14.48,38.1 R1.1 | v14.22,36.58 14.99,37.34
  Bottom 0.203: JP12.1 20.32,53.34 v20.32,49.28 18.8,49.28 7.62,38.1 7.62,37.34 8.38,36.58 v14.22,36.58
N$7
  Top 0.203: RB10.2 JP10.3
N$8
  Top 0.203: JP10.1 33.02,52.07 RG10.2
N$9
  Top 0.203: JP9.4 34.29,38.1 RR9.2
N$10
  Top 0.203: JP9.3 34.29,40.64 RB9.2
N$11
  Top 0.203: RG9.2 JP9.1
N$12  (via drill 0.51)
  Top 0.203: v28.96,34.04 25.91,30.99 25.4,30.99 RR8.2
  Bottom 0.203: v28.96,34.04 28.96,33.27 JP8.4
N$13  (via drill 0.51)
  Top 0.203: v26.92,35.81 25.4,35.81 RB8.2
  Bottom 0.203: v26.92,35.81 28.96,35.81 JP8.3
N$14
  Top 0.203: JP8.1 34.29,35.56 RG8.2
N$15
  Top 0.203: JP7.4 RR7.2
N$16
  Top 0.203: JP7.3 RB7.2
N$17
  Top 0.203: JP7.1 2.54,43.18 RG7.2
N$18
  Top 0.203: JP6.4 2.54,45.72 RR6.2
N$19
  Top 0.203: JP6.3 2.54,48.26 RB6.2
N$20
  Top 0.203: JP6.1 1.52,54.61 5.33,50.8 RG6.2
N$21  (via drill 0.51)
  Top 0.203: v31.5,23.62 31.5,25.4 RR5.2 | JP5.4 v33.27,18.8
  Bottom 0.203: v31.5,23.62 31.5,20.57 v33.27,18.8
N$22  (via drill 0.51)
  Top 0.203: v33.27,25.4 31.5,27.18 31.5,27.94 RB5.2 | v33.27,21.84 35.56,19.56 JP5.3
  Bottom 0.203: v33.27,21.84 v33.27,25.4
N$23  (via drill 0.51)
  Top 0.203: v30.99,29.46 29.72,30.73 29.72,31.75 RG5.2
  Bottom 0.203: v30.99,29.46 30.99,28.96 35.56,24.38 JP5.1
N$24
  Top 0.203: JP4.4 32.77,9.14 31.75,9.14 RR4.2
N$25
  Top 0.203: JP4.3 34.29,10.16 34.29,11.68 31.75,14.22 RB4.2
N$26
  Top 0.203: JP4.1 35.56,14.22 31.75,18.03 RG4.2
N$27
  Top 0.203: JP3.4 3.81,8.89 RR3.2
N$28
  Top 0.203: JP3.3 1.52,8.89 5.33,12.7 RB3.2
N$29
  Top 0.203: JP3.1 3.81,16.51 RG3.2
N$30
  Top 0.203: JP2.4 3.81,19.05 RR2.2
N$31
  Top 0.203: JP2.3 3.81,21.59 RB2.2
N$32
  Top 0.203: JP2.1 2.54,25.4 RG2.2